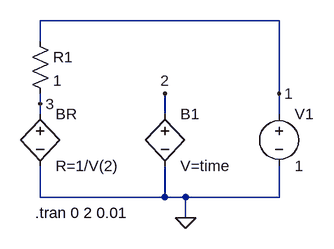
[diagram p0: schematic Fig_2-64_BR_Test-V-time.asc]
Fig_2-64_BR_Test-V-time.asc, the LTspice schematic file:
Version 4
SHEET 1 880 680
WIRE 448 0 80 0
WIRE 80 32 80 0
WIRE 448 112 448 0
WIRE 80 128 80 112
WIRE 80 144 80 128
WIRE 272 144 272 112
WIRE 448 144 448 112
WIRE 80 272 80 224
WIRE 272 272 272 224
WIRE 272 272 80 272
WIRE 304 272 272 272
WIRE 448 272 448 224
WIRE 448 272 304 272
WIRE 304 304 304 272
FLAG 272 112 2
FLAG 80 128 3
FLAG 448 112 1
FLAG 304 304 0
SYMBOL bv 80 128 R0
SYMATTR InstName BR
SYMATTR Value R=1/V(2)
SYMBOL bv 272 128 R0
SYMATTR InstName B1
SYMATTR Value V=time
SYMBOL voltage 448 128 R0
WINDOW 123 0 0 Left 2
WINDOW 39 0 0 Left 2
SYMATTR InstName V1
SYMATTR Value 1
SYMBOL res 64 16 R0
SYMATTR InstName R1
SYMATTR Value 1
TEXT 72 296 Left 2 !.tran 0 2 0.01

The netlist it stands for:
* Fig_2-64_BR_Test-V-time.asc
BR 3 0 R=1/V(2)
B1 2 0 V=time
V1 1 0 1
R1 1 3 1
.tran 0 2 0.01
.backanno
.end